# EAGLE design REV14 (EAGLE 7.4.0)
RFM95W
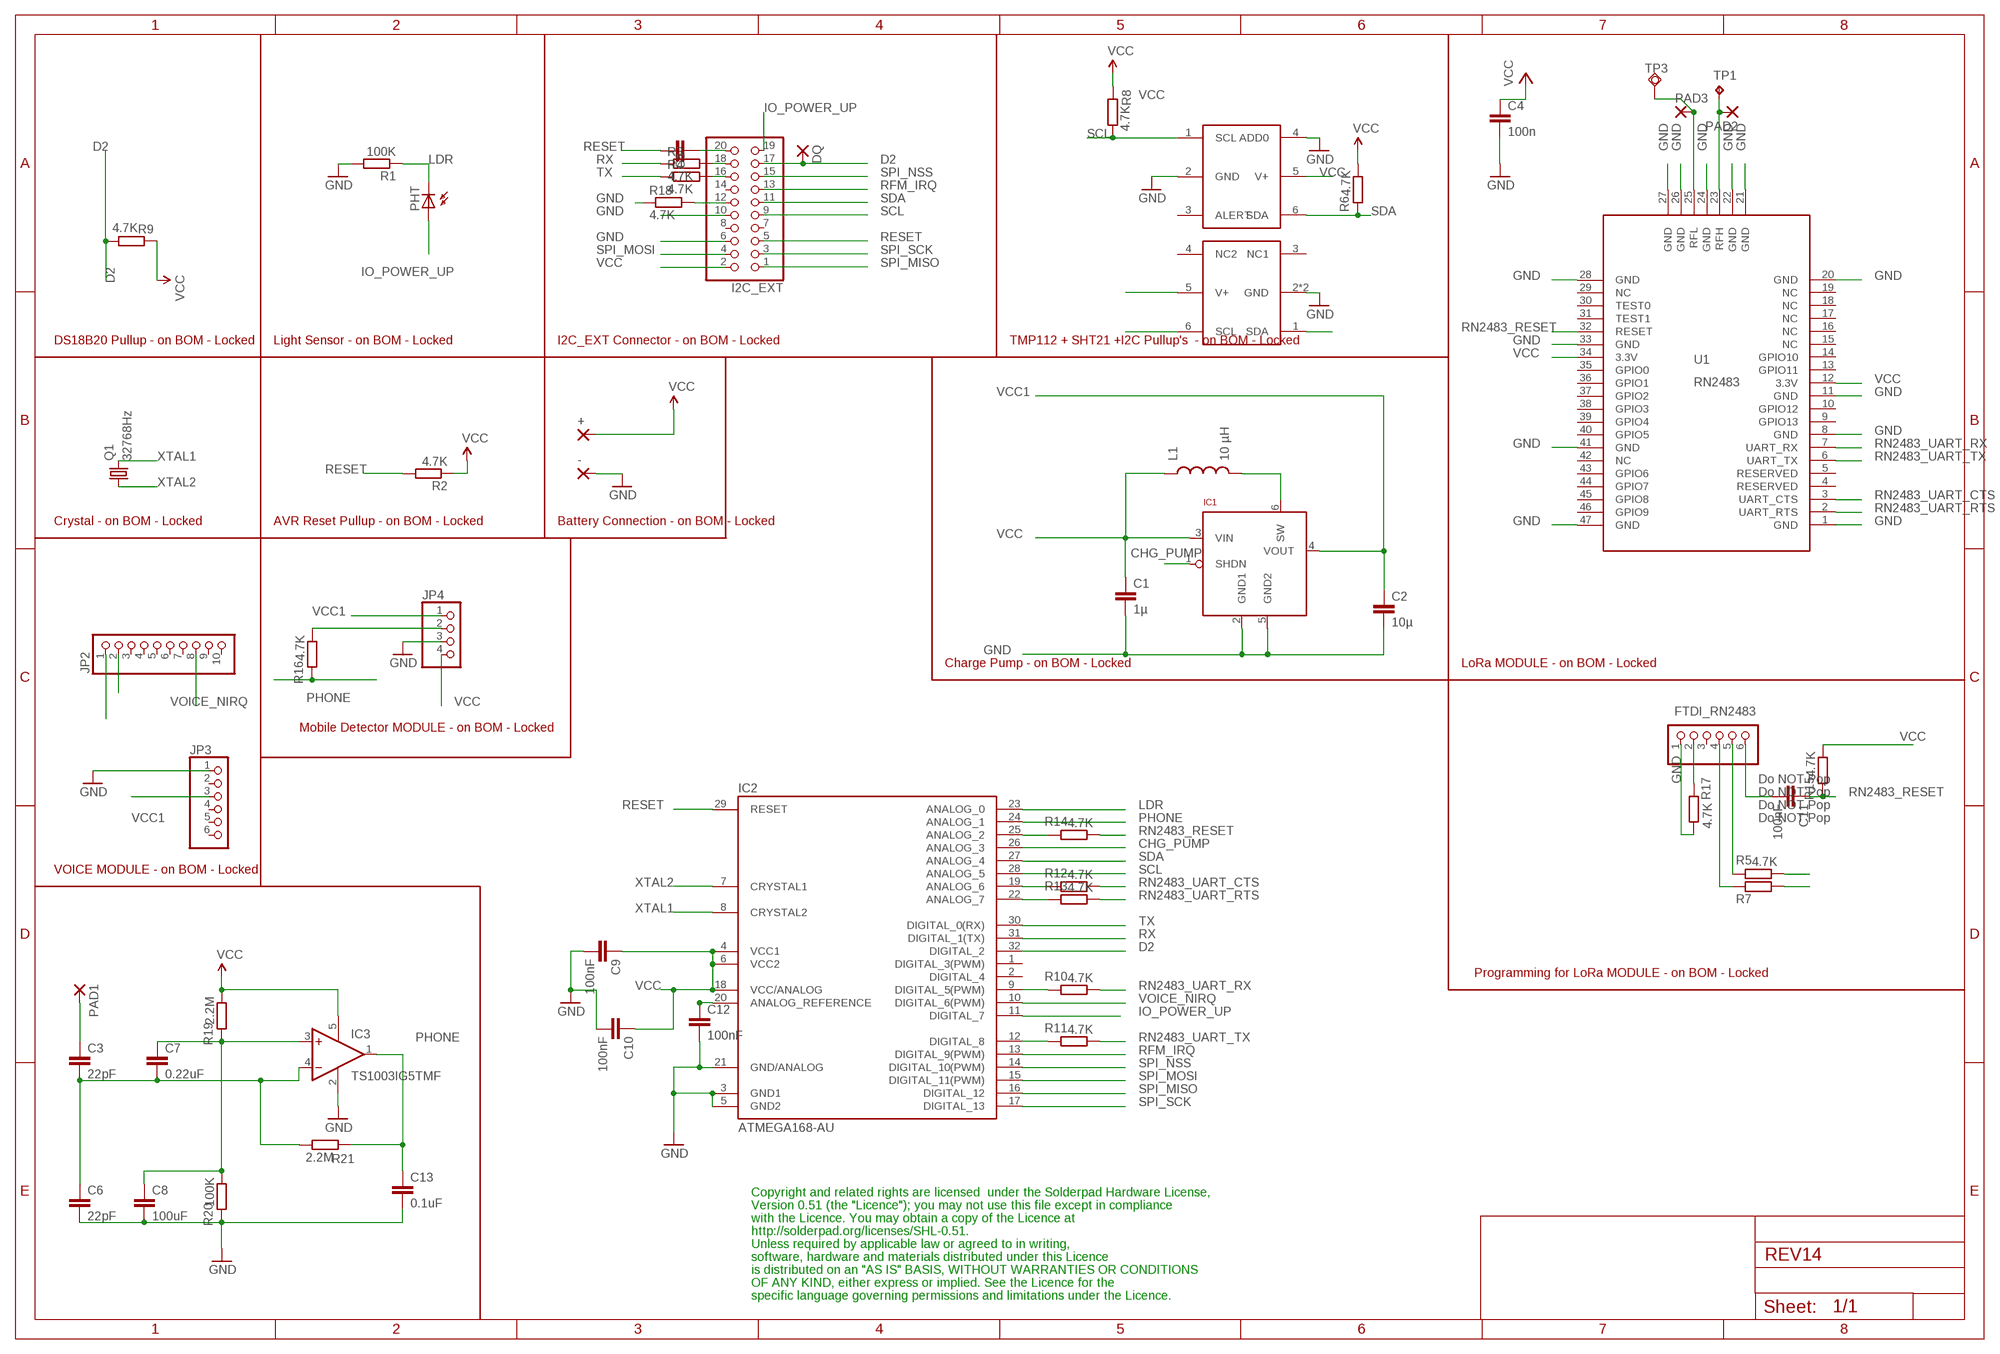
[diagram p0: schematic, sheet 1]

## Parts
+  2,15/1,0  [2,15/1,0]
-  2,15/1,0  [2,15/1,0]
C1  1µ  CAP0603-CAP  [0603-CAP]
C2  10µ  C-EUC0603  [C0603]
C3  22pF  C-EUC0603  [C0603]
C4  100n  C-EUC0603  [C0603]
C5  100nF  C-EUC0603  [C0603]
C6  22pF  C-EUC0603  [C0603]
C7  0.22uF  C-EU050H075X075  [C050H075X075]
C8  100uF  C-EUC1206  [C1206]
C9  100nF  C-EUC0603  [C0603]
C10  100nF  C-EUC0603  [C0603]
C11  100nF  C-EUC0603  [C0603]
C12  100nF  C-EUC0603  [C0603]
C13  0.1uF  C-EUC0603  [C0603]
DQ  2,15/1,0  [2,15/1,0]
FTDI_RN2483  PINHD-1X6  [1X06]
I2C_EXT  PINHD-2X10  [2X10]
IC1  LTC3525  [SC70]
IC2  ATMEGA168-AU  [TQFP32-08]
IC3  TS1003IG5TMF  [TS1003IG5T]
JP2  PINHD-1X10  [1X10]
JP3  PINHD-1X6  [1X06]
JP4  PINHD-1X4  [1X04]
L1  10 µH  INDUCTOR1210  [1210]
PAD1  2,15/1,0  [2,15/1,0]
PAD2  2,15/1,0  [2,15/1,0]
PAD3  2,15/1,0  [2,15/1,0]
PHT  BPX65  [BPX65]
Q1  32768Hz  MC-306  [MC-306]
R1  100K  R-EU_R0603  [R0603]
R2  4.7K  R-EU_R0603  [R0603]
R3  4.7K  R-EU_R0603  [R0603]
R4  4.7K  R-EU_R0603  [R0603]
R5  4.7K  R-EU_R0603  [R0603]
R6  4.7K  R-EU_R0603  [R0603]
R7  4.7K  R-EU_R0603  [R0603]
R8  4.7K  R-EU_R0603  [R0603]
R9  4.7K  R-EU_R0603  [R0603]
R10  4.7K  R-EU_R0603  [R0603]
R11  4.7K  R-EU_R0603  [R0603]
R12  4.7K  R-EU_R0603  [R0603]
R13  4.7K  R-EU_R0603  [R0603]
R14  4.7K  R-EU_R0603  [R0603]
R15  4.7K  R-EU_R0603  [R0603]
R16  4.7K  R-EU_R0603  [R0603]
R17  4.7K  R-EU_R0603  [R0603]
R18  4.7K  R-EU_R0603  [R0603]
R19  2.2M  R-EU_R0603  [R0603]
R20  100K  R-EU_R0603  [R0603]
R21  2.2M  R-EU_R0603  [R0603]
TP1  TPB1,27  [B1,27]
TP3  TPSQTP07R  [TP07R]
U1  RN2483  [RN2483]
U2  TMP112  [TMP112]
U$4  SHT21  [SHT21]

## Nets
CHG_PUMP [supply]: IC1.1(SHDN) IC2.26(ANALOG_3)
D2: DQ.1(P) I2C_EXT.17 IC2.32(DIGITAL_2) R9.1
GND [supply]: -.1(P) C1.2 C2.2 C4.2 C6.2 C8.2 C9.2 C10.2 C12.2 C13.2 FTDI_RN2483.1 I2C_EXT.6 I2C_EXT.10 IC1.2(GND1) IC1.5(GND2) IC2.3(GND1) IC2.5(GND2) IC2.21(GND/ANALOG) IC3.2(V-) JP3.1 JP4.3 R1.2 R17.2 R18.1 R20.2 U1.1(GND) U1.8(GND) U1.11(GND) U1.20(GND) U1.21(GND) U1.22(GND) U1.24(GND) U1.26(GND) U1.27(GND) U1.28(GND) U1.33(GND) U1.41(GND) U1.47(GND) U2.2(GND) U2.4(ADD0) U$4.2(GND) U$4.P$1(GND)
IO_POWER_UP [supply]: I2C_EXT.19 IC2.11(DIGITAL_7) PHT.A
LDR: IC2.23(ANALOG_0) PHT.K(C) R1.1
N$1: I2C_EXT.18 R3.2
N$2: C11.2 FTDI_RN2483.6
N$3: I2C_EXT.16 R4.2
N$4: C5.2 I2C_EXT.20
N$5: FTDI_RN2483.4 R7.2
N$6 [supply]: C12.1 IC2.20(ANALOG_REFERENCE)
N$7: FTDI_RN2483.5 R5.2
N$8: IC2.9(DIGITAL_5(PWM)) R10.2
N$9: IC2.12(DIGITAL_8) R11.2
N$10 [supply]: IC1.6(SW) L1.2
N$11: IC2.19(ANALOG_6) R12.2
N$12: IC2.22(ANALOG_7) R13.2
N$13: IC2.25(ANALOG_2) R14.2
N$14: FTDI_RN2483.2 R17.1
N$16: JP4.2 R16.1
N$17 [supply]: I2C_EXT.12 R18.2
N$18: C3.1 PAD1.1(P)
N$19: C3.2 C6.1 C7.2 IC3.4(-IN) R21.1
N$21: C7.1 C8.1 IC3.3(+IN) R19.2 R20.1
N$22 [ant]: PAD2.1(P) TP1.TP U1.23(RFH)
N$33 [ant]: PAD3.1(P) TP3.TP U1.25(RFL)
PHONE: C13.1 IC2.24(ANALOG_1) IC3.1(OUT) R16.2 R21.2
RESET: C5.1 I2C_EXT.5 IC2.29(RESET) R2.2
RFM_IRQ: I2C_EXT.13 IC2.13(DIGITAL_9(PWM))
RN2483_RESET: C11.1 R14.1 R15.2 U1.32(RESET)
RN2483_UART_CTS: R12.1 U1.3(UART_CTS)
RN2483_UART_RTS: R13.1 U1.2(UART_RTS)
RN2483_UART_RX: R7.1 R10.1 U1.7(UART_RX)
RN2483_UART_TX: R5.1 R11.1 U1.6(UART_TX)
RX: IC2.31(DIGITAL_1(TX)) R3.1
SCL: I2C_EXT.9 IC2.28(ANALOG_5) JP2.1 R8.1 U2.1(SCL) U$4.6(SCL)
SDA: I2C_EXT.11 IC2.27(ANALOG_4) JP2.2 R6.2 U2.6(SDA) U$4.1(SDA)
SPI_MISO: I2C_EXT.1 IC2.16(DIGITAL_12)
SPI_MOSI: I2C_EXT.4 IC2.15(DIGITAL_11(PWM))
SPI_NSS: I2C_EXT.15 IC2.14(DIGITAL_10(PWM))
SPI_SCK: I2C_EXT.3 IC2.17(DIGITAL_13)
TX: IC2.30(DIGITAL_0(RX)) R4.1
VCC [supply]: +.1(P) C1.1 C4.1 C9.1 C10.1 I2C_EXT.2 IC1.3(VIN) IC2.4(VCC1) IC2.6(VCC2) IC2.18(VCC/ANALOG) IC3.5(V+) JP4.4 L1.1 R2.1 R6.1 R8.2 R9.2 R15.1 R19.1 U1.12(3.3V) U1.34(3.3V) U2.5(V+) U$4.5(V+)
VCC1 [supply]: C2.1 IC1.4(VOUT) JP3.3 JP4.1
VOICE_NIRQ: IC2.10(DIGITAL_6(PWM)) JP2.8
XTAL1: IC2.8(CRYSTAL2) Q1.4
XTAL2: IC2.7(CRYSTAL1) Q1.1
Unconnected: FTDI_RN2483.3 I2C_EXT.7 I2C_EXT.8 I2C_EXT.14 IC2.1(DIGITAL_3(PWM)) IC2.2(DIGITAL_4) JP2.3 JP2.4 JP2.5 JP2.6 JP2.7 JP2.9 JP2.10 JP3.2 JP3.4 JP3.5 JP3.6 U1.4(RESERVED) U1.5(RESERVED) U1.9(GPIO13) U1.10(GPIO12) U1.13(GPIO11) U1.14(GPIO10) U1.15(NC) U1.16(NC) U1.17(NC) U1.18(NC) U1.19(NC) U1.29(NC) U1.30(TEST0) U1.31(TEST1) U1.35(GPIO0) U1.36(GPIO1) U1.37(GPIO2) U1.38(GPIO3) U1.39(GPIO4) U1.40(GPIO5) U1.42(NC) U1.43(GPIO6) U1.44(GPIO7) U1.45(GPIO8) U1.46(GPIO9) U2.3(ALERT) U$4.3(NC1) U$4.4(NC2)

## Notes on the sheet
- DS18B20 Pullup - on BOM - Locked | Light Sensor - on BOM - Locked | I2C_EXT Connector - on BOM - Locked | TMP112 + SHT21 +I2C Pullup's  - on BOM - Locked
- Crystal - on BOM - Locked | AVR Reset Pullup - on BOM - Locked | Battery Connection - on BOM - Locked
- Charge Pump - on BOM - Locked | LoRa MODULE - on BOM - Locked
- Mobile Detector MODULE - on BOM - Locked
- Do NOT Pop
- Do NOT Pop
- Do NOT Pop
- Do NOT Pop
- VOICE MODULE - on BOM - Locked
- Programming for LoRa MODULE - on BOM - Locked
- Copyright and related rights are licensed  under the Solderpad Hardware License,
- Version 0.51 (the "Licence"); you may not use this file except in compliance
- with the Licence. You may obtain a copy of the Licence at
- http://solderpad.org/licenses/SHL-0.51.
- Unless required by applicable law or agreed to in writing,
- software, hardware and materials distributed under this Licence
- is distributed on an "AS IS" BASIS, WITHOUT WARRANTIES OR CONDITIONS
- OF ANY KIND, either express or implied. See the Licence for the
- specific language governing permissions and limitations under the Licence.

## Library data of the parts
+ - DQ PAD1-PAD3 = wirepad:2,15/1,0: THROUGH-HOLE PAD
C1 = SparkFun:CAP: Capacitor Standard 0603 ceramic capacitor, and 0.1" leaded capacitor.
C2 C4 C7 C8 = rcl:C-EU: CAPACITOR, European symbol
C3 C5 C6 C9-C13 = resistor:C-EU: CAPACITOR, European symbol
FTDI_RN2483 JP3 = pinhead:PINHD-1X6: PIN HEADER
I2C_EXT = pinhead:PINHD-2X10: PIN HEADER
IC1 = JeeLabs:LTC3525
IC2 = Arduino-AVR:ATMEGA168
IC3 = TS1003IG5T:TS1003IG5T: Low Power Single Op Amp Source: http://cache.national.com/ds/LM/LM321.pdf
JP2 = pinhead:PINHD-1X10: PIN HEADER
JP4 = pinhead:PINHD-1X4: PIN HEADER
L1 = SparkFun:INDUCTOR: Inductors Basic Inductor/Choke - 0603 and 1206. Footprints are not proven and vary greatly between part numbers.
PHT = opto-trans-siemens:BPX65: PHOTO DIODE; MPN: BPX65.; OC_FARNELL: 327451; OC_NEWARK: 06WX2764
Q1 = crystal:MC-306: kHz RANGE CRYSTAL UNIT SMD Source: MC-306_405_406_E07X.PDF Homepage <http://www.epsontoyocom.co.jp>; MPN: MC-306 60.0KHZ 100PPM ,12.5PF; OC_FARNELL: 1278040; OC_NEWARK: 31M5576
R1-R21 = resistor:R-EU_: RESISTOR, European symbol
TP1 = testpad:TP: Test pad
TP3 = testpad:TPSQ: Test pad
U1 = RFM95W-RN2483:RN2483
U2 = TMP112_2:TMP112
U$4 = SHT21:SHT21: Tempsensor RS No: 709-8868 MRF No: TMP112AIDRLT

## Net classes
0 default: width 0.203 mm, drill 0.5 mm
1 supply: width 0.4 mm, drill 0.5 mm, clearance 0.203 mm
2 ant: width 2.184 mm, drill 0.5 mm

## Board
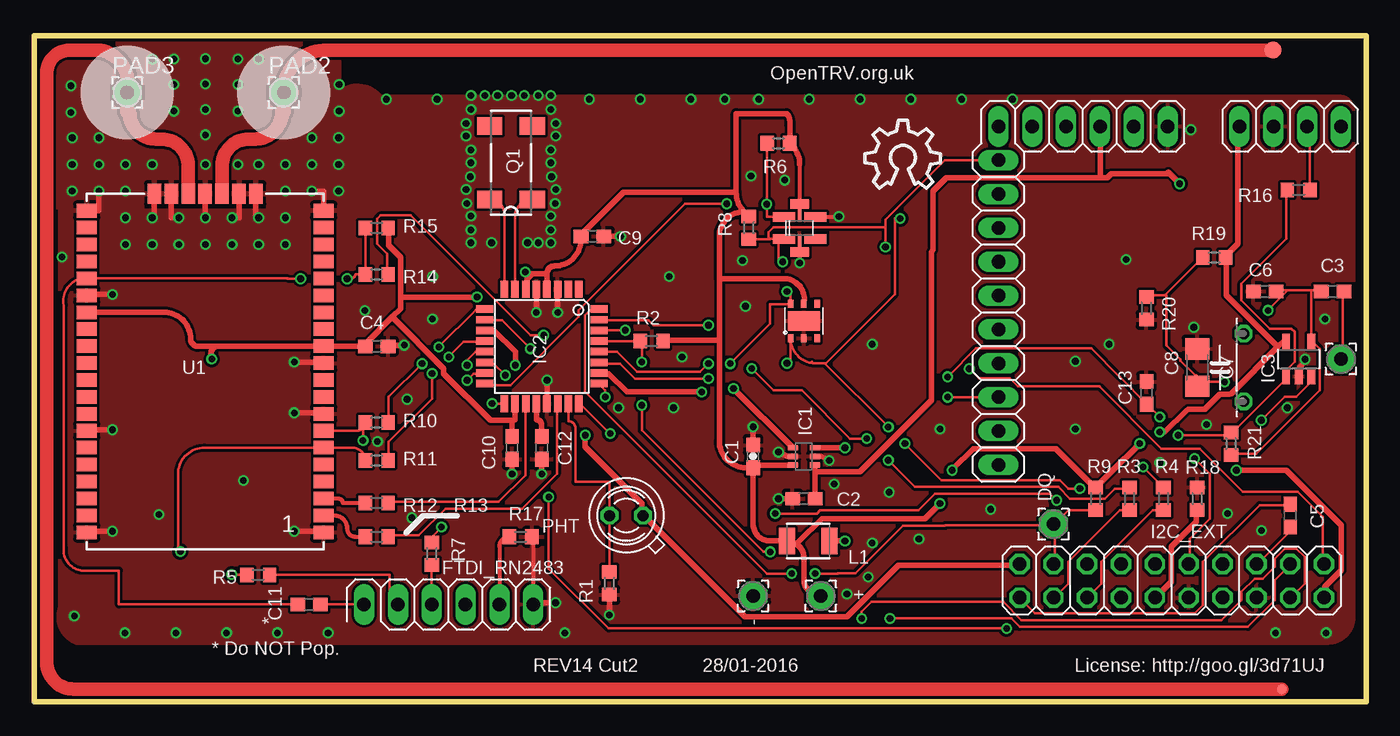
[diagram p1: board, top side]
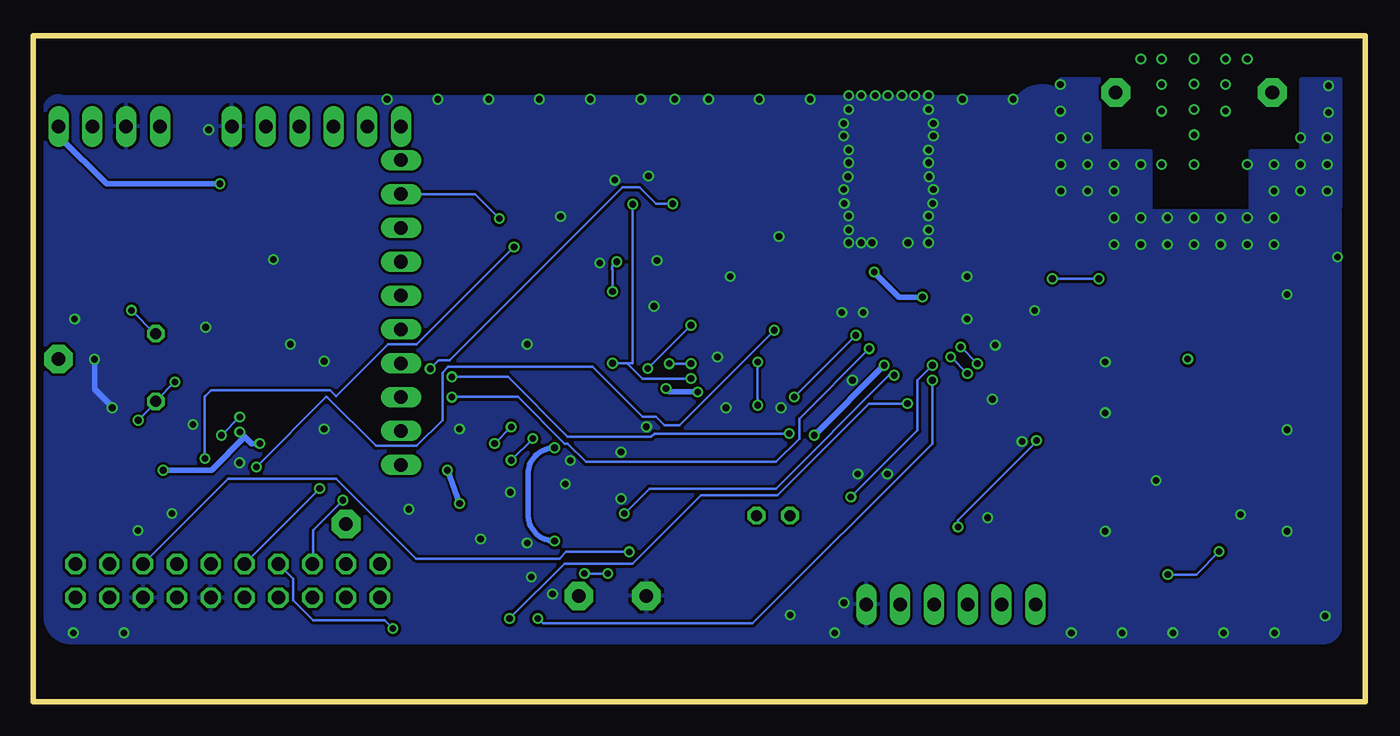
[diagram p2: board, bottom side, seen from below]

Size 100 x 50 mm. Coordinates in mm from the lower left corner, seen from the top.
Outline: 0,50 0,0 100,0 100,50 0,50
Copper layers (1*16): Top 0.035mm / dielectric 1.5mm / Bottom 0.035mm
Design rules "PMServicesStd *": minimum track width 8mil, minimum drill 0.5mm, track to track 8mil, track to pad 8mil, pad to pad 8mil, via to via 8mil, smd to smd 0mil, copper to edge 10mil, drill to drill 10mil, minimum pad ring 10mil, minimum via ring 6mil, stop-mask expansion 2mil, vias tented up to drill 100mil, thermal gap 10mil

### Footprints (pad centres in the part's own frame; a part is rotated, then mirrored left to right if it is on the bottom)
2,15/1,0 = drill 1.016 pad 2.159 octagon: 1 0,0
0603-CAP = smd 1.1 x 1: 1 -0.85,0; 2 0.85,0
C0603 = smd 1.1 x 1: 1 -0.85,0; 2 0.85,0
C050H075X075 = drill 0.813 octagon: 1 -2.54,0; 2 2.54,0
C1206 = smd 1.6 x 1.8: 1 -1.4,0; 2 1.4,0
1X06 = drill 1.016 long: 1 -6.35,0; 2 -3.81,0; 3 -1.27,0; 4 1.27,0; 5 3.81,0; 6 6.35,0
2X10 = drill 1.016 octagon: 1 -11.43,-1.27; 2 -11.43,1.27; 3 -8.89,-1.27; 4 -8.89,1.27; 5 -6.35,-1.27; 6 -6.35,1.27; 7 -3.81,-1.27; 8 -3.81,1.27; 9 -1.27,-1.27; 10 -1.27,1.27; 11 1.27,-1.27; 12 1.27,1.27; 13 3.81,-1.27; 14 3.81,1.27; 15 6.35,-1.27; 16 6.35,1.27; 17 8.89,-1.27; 18 8.89,1.27; 19 11.43,-1.27; 20 11.43,1.27
SC70 = smd 0.4 x 0.75: 1 -0.65,-0.825; 2 0,-0.825; 3 0.65,-0.825; 4 0.65,0.825; 5 0,0.825; 6 -0.65,0.825
TQFP32-08 = smd 1.27 x 0.559: 1 -4.293,2.8; 2 -4.293,2; 3 -4.293,1.2; 4 -4.293,0.4; 5 -4.293,-0.4; 6 -4.293,-1.2; 7 -4.293,-2; 8 -4.293,-2.8; 17 4.293,-2.8; 18 4.293,-2; 19 4.293,-1.2; 20 4.293,-0.4; 21 4.293,0.4; 22 4.293,1.2; 23 4.293,2; 24 4.293,2.8 | smd 0.559 x 1.27: 9 -2.8,-4.293; 10 -2,-4.293; 11 -1.2,-4.293; 12 -0.4,-4.293; 13 0.4,-4.293; 14 1.2,-4.293; 15 2,-4.293; 16 2.8,-4.293; 25 2.8,4.293; 26 2,4.293; 27 1.2,4.293; 28 0.4,4.293; 29 -0.4,4.293; 30 -1.2,4.293; 31 -2,4.293; 32 -2.8,4.293
TS1003IG5T = smd 0.6 x 1.2: 1 -0.95,-1.306; 2 0,-1.306; 3 0.95,-1.306; 4 0.95,1.306; 5 -0.95,1.306
1X10 = drill 1.016 long: 1 -11.43,0; 2 -8.89,0; 3 -6.35,0; 4 -3.81,0; 5 -1.27,0; 6 1.27,0; 7 3.81,0; 8 6.35,0; 9 8.89,0; 10 11.43,0
1X04 = drill 1.016 long: 1 -3.81,0; 2 -1.27,0; 3 1.27,0; 4 3.81,0
1210 = smd 1.2 x 2: 1 -1.6,0; 2 1.6,0
BPX65 = drill 0.813 octagon: A -0.889,-0.889; K 0.889,0.889
MC-306 = smd 1.3 x 1.9: 1 -2.75,-1.6; 2 2.75,-1.6; 3 2.75,1.6; 4 -2.75,1.6
R0603 = smd 1 x 1.1: 1 -0.85,0; 2 0.85,0
B1,27 = smd 1.27 x 1.27: TP 0,0
TP07R = smd 0.7 x 0.7: TP 0,0
RN2483 = smd 1.524 x 1.016: 1 17.78,1.27; 2 17.78,2.54; 3 17.78,3.81; 4 17.78,5.08; 5 17.78,6.35; 6 17.78,7.62; 7 17.78,8.89; 8 17.78,10.16; 9 17.78,11.43; 10 17.78,12.7; 11 17.78,13.97; 12 17.78,15.24; 13 17.78,16.51; 14 17.78,17.78; 15 17.78,19.05; 16 17.78,20.32; 17 17.78,21.59; 18 17.78,22.86; 19 17.78,24.13; 20 17.78,25.4; 28 0,25.4; 29 0,24.13; 30 0,22.86; 31 0,21.59; 32 0,20.32; 33 0,19.05; 34 0,17.78; 35 0,16.51; 36 0,15.24; 37 0,13.97; 38 0,12.7; 39 0,11.43; 40 0,10.16; 41 0,8.89; 42 0,7.62; 43 0,6.35; 44 0,5.08; 45 0,3.81; 46 0,2.54; 47 0,1.27 | smd 1.016 x 1.524: 21 12.7,26.67; 22 11.43,26.67; 23 10.16,26.67; 24 8.89,26.67; 25 7.62,26.67; 26 6.35,26.67; 27 5.08,26.67
TMP112 = smd 0.285 x 0.7: 1 -0.5,-0.825; 2 0,-0.825; 3 0.5,-0.825; 4 0.5,0.825; 5 0,0.825; 6 -0.5,0.825; 7 0.777,-0.825; 8 1.325,-0.825; 9 1.05,-0.825; 10 1.868,-0.826; 11 1.595,-0.826; 12 -1.863,-0.825; 13 -1.314,-0.825; 14 -1.59,-0.825; 15 -0.772,-0.825; 16 -1.044,-0.825; 17 -1.86,0.822; 18 -1.312,0.822; 19 -1.587,0.822; 20 -0.769,0.821; 21 -1.041,0.821; 22 0.766,0.824; 23 1.315,0.824; 24 1.039,0.824; 25 1.857,0.823; 26 1.585,0.823; 27 -0.548,1.797; 28 0,1.797; 29 -0.275,1.797; 30 0.543,1.797; 31 0.271,1.797; 32 0.001,1.383; 33 -0.548,-1.798; 34 0,-1.798; 35 -0.275,-1.798; 36 0.543,-1.799; 37 0.271,-1.799; 38 0,-1.322
SHT21 = smd 0.4 x 0.6: 1 -1,-1.3; 2 0,-1.3; 3 1,-1.3; 4 1,1.3; 5 0,1.3; 6 -1,1.3 | smd 2.4 x 1.5: P$1 0,0

### Placement (x,y rotation side)
+  59.05,7.94 270 top
-  53.98,7.94 270 top
C1  53.98,18.41 90 top
C2  57.78,15.24 180 top
C3  97.47,30.8 180 top
C4  25.72,26.67 0 top
C5  94.3,13.97 90 top
C6  92.39,30.8 180 top
C7  90.81,25.08 90 top
C8  87.31,25.08 90 top
C9  41.91,34.92 0 top
C10  35.88,19.05 270 top
C11  20.64,7.3 0 top
C12  38.1,19.05 270 top
C13  83.5,23.18 90 top
DQ  76.52,13.34 90 top
FTDI_RN2483  31.11,7.3 180 top
I2C_EXT  85.41,9.08 180 top
IC1  57.78,18.41 270 top
IC2  38.1,26.67 270 top
IC3  94.93,25.72 0 top
JP2  72.39,29.21 270 top
JP3  78.74,43.18 180 top
JP4  94.3,43.18 180 top
L1  58.1,12.06 0 top
PAD1  98.11,25.72 0 top
PAD2  18.73,45.72 0 top
PAD3  6.99,45.72 0 top
PHT  44.45,13.97 135 top
Q1  35.8,40.45 90 top
R1  43.18,8.89 270 top
R2  46.35,27.07 180 top
R3  82.23,15.24 270 top
R4  84.77,15.24 270 top
R5  16.83,9.53 0 top
R6  55.88,41.91 180 top
R7  29.84,11.11 270 top
R8  53.66,35.56 90 top
R9  79.69,15.24 90 top
R10  25.72,20.95 0 top
R11  25.72,18.1 0 top
R12  25.72,14.92 0 top
R13  25.72,12.38 0 top
R14  25.72,32.07 0 top
R15  25.72,35.56 180 top
R16  94.93,38.42 180 top
R17  36.51,12.38 0 top
R18  87.31,15.24 270 top
R19  88.58,33.34 180 top
R20  83.5,29.53 270 top
R21  89.85,19.37 90 top
TP1  93,48.9 0 top
TP3  93.66,0.95 0 top
U1  3.95,11.45 0 top
U2  57.47,35.56 0 top
U$1  [OSHW_10X200_NOTEXT]  62.38,38.54 0 top
U$4  57.78,28.57 0 top

### Tracks (layer width: path | path; a pad name or v marks a point on that pad's centre or on a via)
CHG_PUMP  (via drill 0.5)
  Top 0.4: v52.5,23.5 56.88,19.12 IC1.1 | v50.12,23.25 44.5,23.25 43.12,24.62 42.5,24.62 IC2.26
  Bottom 0.4: v52.5,23.5 52.25,23.25 v50.12,23.25
D2  (via drill 0.5)
  Top 0.203: R9.1 79.62,14.38 77.62,14.38 76.62,13.38 DQ.1 | v56.88,9.62 55,9.62 41.38,23.25 41.38,29 41.75,29.38 42.38,29.38 IC2.32 | v58.62,9.62 60.33,9.62 60.35,9.65 61.67,9.65 65.23,13.21 68.38,13.21 68.39,13.25 76.5,13.25 DQ.1 | I2C_EXT.17 76.62,10.38 76.62,13.25 DQ.1
  Bottom 0.203: v58.62,9.62 v56.88,9.62
GND  (via drill 0.5)
  Top 0.305: U2.4 60.42,36.38 | U2.2 v57.47,32.93 | R17.2 arc-90 37.47,12.28 FTDI_RN2483.1
  Top 0.4: v95.4,25.7 95.4,25.5 95,25.09 95,24.49 IC3.2
  Top 0.406: 60.42,36.38 v60.42,36.42 | C4.2 26.57,26.76 v27.78,26.76 | U1.11 21.73,25.49 v19.52,25.49 | IC2.21 v38.5,24.13 | IC2.5 v37.7,29.21 | IC2.3 v39.3,29.21 | C10.2 v35.88,17.09 | R1.2 v43.18,6.51 | C9.2 v44.02,34.92 | U1.1 21.73,12.79 v19.52,12.79 | U1.8 21.73,21.68 v19.52,21.68 | U1.47 3.95,12.79 v5.87,12.79 | U1.41 3.95,20.41 v5.87,20.41 | U1.33 3.95,30.57 v5.87,30.57 | U1.20 21.73,38.32 v20.86,38.32 | v4.86,38.32 4.86,36.85 U1.28 | U1.21 16.65,36.32 v16.86,36.32 | U1.22 15.38,36.32 v14.86,36.32 | U1.24 12.84,36.32 v12.86,36.32 | U1.26 10.3,36.32 v10.86,36.32 | U1.27 9.03,36.32 v8.86,36.32 | FTDI_RN2483.1 37.47,7.43 v39.15,7.43 | C12.2 v38.1,17.09 | IC1.5 59.05,18.41 v59.69,18.1 | IC1.2 56.52,18.41 v55.88,18.73 | C1.2 v53.98,20.64 v53.97,20.64 | C2.2 v55.88,15.24
  Bottom 0.4: v95.4,25.7 95.4,23.47 94.08,22.15 v94.07,22.07
  other vias: 14.86,34.32 18.86,34.32 18.86,36.32 16.86,34.32 12.86,34.32 10.86,34.32 8.86,34.32 6.86,34.32 6.86,36.32 6.86,38.32 6.86,40.32 4.86,40.32 2.86,40.32 2.86,38.32 4.86,42.32 2.86,42.32 2.76,44.23 2.76,46.23 8.86,40.32 12.86,40.32 15.3,40.32 16.86,40.32 18.86,40.32 18.86,38.32 20.86,40.32 20.86,42.32 22.86,42.32 22.86,40.32 22.86,38.32 32.8,45.5 34.8,45.5 38.8,45.5 36.8,45.5 32.8,34.45 34.34,34.45 38.8,34.45 37.04,34.45 32.43,38.45 32.8,40.45 32.8,44.45 32.43,42.45 32.8,36.45 39.16,38.45 38.8,40.45 38.8,44.45 39.16,42.45 38.8,36.45 86.83,42.92 12.86,46.35 12.86,44.45 12.86,42.55 15.71,16.6 9.37,14.06 53.81,39.46 56.35,39.15 53.18,33.11 37.84,34.45 38.8,35.4 38.84,39.4 38.8,41.4 39.16,43.4 39.11,37.4 32.8,35.4 32.75,39.4 32.8,41.4 32.43,43.4 32.48,37.4 33.84,45.5 37.84,45.5 35.84,45.5 22.89,44.32 22.89,46.32 15.3,44.32 15.3,46.32 10.49,44.32 10.49,46.32 8.86,48.23 16.86,48.23 12.86,48.26 15.3,48.23 10.49,48.23 3.02,6.44 2.1,33.37 61.02,8.1 62.61,9.37 66.42,12.22 64.19,15.72 60.07,16.35 89.59,14.13 84.52,17.94 80.7,26.83 81.97,33.18 87.06,28.1 47.69,31.91 62.92,26.83 29.91,31.91 24.82,29.37 53.4,29.69 48,22.07 29.91,28.73 71.81,14.45 28.35,13.81 28,22.7 25.78,19.53 48.64,25.88 43.88,22.07 62.92,11.91 92.14,12.86 88.01,20.8 96.9,28.73 26.45,45.21 30.25,45.21 41.69,45.21 45.49,45.21 49.3,45.21 51.84,45.21 54.38,45.21 58.2,45.21 62.01,45.21 65.81,45.21 69.62,45.21 73.44,45.21 6.83,5.17 10.63,5.17 14.45,5.17 18.25,5.17 22.07,5.17 39.84,5.17 97,5.17 93.19,5.17 68,20.48 78.17,20.48 78.17,25.56
  pour Top: 22.86,50 22.86,37.15 0,37.15 0,50
  pour Top: 4.76,49.85 4.76,37.15 1.91,37.15 1.91,49.85
  pour Bottom: 4.76,46.67 4.76,37.15 1.91,37.15 1.91,46.67
  pour Top: 20,37.47 20,41.27 16.19,41.27 16.19,37.47
  pour Bottom: 20,36.2 20,41.27 16.19,41.27 16.19,36.2
  pour Bottom: 8.57,36.2 8.57,41.27 4.76,41.27 4.76,36.2
  pour Top: 8.57,37.47 8.57,49.85 4.76,49.85 4.76,37.47
  pour Bottom: 22.86,46.67 22.86,37.15 20,37.15 20,46.67
  pour Top: 22.86,46.67 22.86,37.15 20,37.15 20,46.67
  pour Top: 22.86,24.13 22.86,5.08 arc90 19.68,4.45 97.16,4.45 arc90 99.06,6.35 99.06,44.45 arc90 97.79,45.4 26.04,45.4 arc90 22.86,45.72 22.86,28.26 arc90
  pour Bottom: 22.86,24.13 22.86,10.16 arc90 23.5,4.45 97.16,4.45 arc90 99.06,6.35 99.06,44.77 arc90 97.79,45.4 26.04,45.4 arc90 22.86,45.72 22.86,28.26 arc90
  pour Top: 24.13,36.83 1.91,36.83 1.91,6.99 arc90 3.17,4.45 26.04,4.45 26.04,34.92 arc90
  pour Bottom: 24.13,36.83 1.91,36.83 1.91,5.71 arc90 3.17,4.45 26.04,4.45 26.04,34.92 arc90
IO_POWER_UP  (via drill 0.5)
  Top 0.4: v36.12,25.25 36.12,26.25 34.5,27.88 33.88,27.88 IC2.11 | v41.38,20 41.38,19.12 45.62,14.88 45.62,14 PHT.A 45.88,13.88 53.38,6.38 61,6.38 64.88,10.25 73.88,10.25 I2C_EXT.19
  Bottom 0.4: v41.38,20 v36.12,25.25
LDR
  Top 0.203: R1.1 PHT.K 43.19,16.51 40.64,16.51 40.64,20.52 arc90 40.1,21.06 IC2.23
N$1
  Top 0.203: R3.2 82.12,14.38 81.5,14.38 77.62,10.5 77.62,8.88 76.62,7.88 I2C_EXT.18
N$2
  Top 0.203: C11.2 FTDI_RN2483.6
N$3
  Top 0.203: R4.2 84.75,14.38 84,14.38 80.12,10.5 80.12,8.88 79.12,7.88 I2C_EXT.16
N$4
  Top 0.203: C5.2 94.25,14.75 92,14.75 87.75,10.5 87.75,7.25 87.12,6.62 75.12,6.62 74,7.75 I2C_EXT.20
N$5
  Top 0.203: R7.2 FTDI_RN2483.4
N$6
  Top 0.406: IC2.20 37.7,21.17 arc-90 38.1,20.77 C12.1
N$7
  Top 0.203: R5.2 26.67,9.53 26.67,7.62 FTDI_RN2483.5
N$8  (via drill 0.5)
  Top 0.203: v29.12,25.38 26.62,22.88 26.62,21 R10.2 | v30.38,26.62 33.12,29.38 33.75,29.38 IC2.9
  Bottom 0.203: v30.38,26.62 v29.12,25.38
N$9  (via drill 0.5)
  Top 0.203: v29.88,24.62 29.88,22.75 26.62,19.5 26.62,18.12 R11.2 | v31.12,25.88 32.25,27 33.75,27 IC2.12
  Bottom 0.203: v31.12,25.88 v29.88,24.62
N$10  (via drill 0.5)
  Top 0.406: L1.2 v60.87,12.06 | v60.87,19.07 IC1.6
  Bottom 0.406: v60.87,12.06 arc90 62.87,14.06 62.87,17.07 arc90 v60.87,19.07
N$11
  Top 0.203: R12.2 26.62,15 34.88,15 36.88,17 36.88,22.38 IC2.19
N$12
  Top 0.203: R13.2 26.62,12.5 28.88,12.5 30.88,14.5 36.62,14.5 39.25,17.12 39.25,22.38 IC2.22
N$13  (via drill 0.5)
  Top 0.203: v38.25,27.5 37.25,27.5 28.25,36.5 26,36.5 25.75,36.25 25.75,34.38 26.5,33.62 26.5,32.12 R14.2 | v42.88,22.88 42.88,23.38 42.5,23.75 IC2.25
  Bottom 0.203: v42.88,22.88 v38.25,27.5
N$14
  Top 0.305: R17.1 arc90 34.92,11.64 FTDI_RN2483.2
N$16
  Top 0.203: R16.1 95.75,38.5 95.75,43 95.62,43.12 JP4.2
N$17
  Top 0.4: R18.2 87.25,14.38 87.25,13.5 85.38,11.62 85.38,9 84.25,7.88 I2C_EXT.12
N$18
  Top 0.203: C3.1 98.25,30.75 98.25,25.88 98.12,25.75 PAD1.1
N$19  (via drill 0.5)
  Top 0.203: 95.88,30.88 96.5,30.88 C3.2 | 95.88,30.88 94.12,30.88 | 94.12,30.88 93.25,30.88 C6.1 | R21.1 89.88,18.62 91.75,18.62 96.5,23.38 96.5,26.5 96,27 IC3.4 95.88,27.12 95.88,30.88 | 94.12,30.88 v92.62,29.38
  Bottom 0.203: v92.62,29.38 90.88,27.62 C7.2
N$21  (via drill 0.5)
  Top 0.203: v92.12,21.12 93.88,22.88 94.75,22.88 95.88,24 95.88,24.38 IC3.3 | 84.94,30.56 87.62,33.25 R19.2 | 84.94,30.56 84.88,30.5 83.62,30.5 R20.1 | 87.25,24.5 87.25,24.49 | 87.25,24.49 87.25,24.25 C8.1 87.38,24.12 87.5,24 v89.38,24 | 84.94,30.56 85,30.5 85,26.75 85.04,26.72 86.06,25.7 86.06,25.6 87.17,24.49 87.25,24.49
  Bottom 0.203: v92.12,21.12 90.75,22.5 C7.1 90.75,22.62 v89.38,24
N$22
  Top 0.406: 18.73,44.23 18.6,44.23
  Top 1.016: U1.23 14.11,40.23 arc-90 16.11,42.23 16.6,42.23 arc90 18.6,44.23 | 18.73,44.23 PAD2.1 18.73,45.94 arc-90 22,48.9 TP1.TP
  Top 2.184: 18.8,45.72 PAD2.1
N$33
  Top 0.406: 6.99,44.23 7.15,44.23
  Top 1.016: 7.15,44.23 arc90 9.15,42.23 9.57,42.23 arc-90 11.57,40.23 U1.25 | 6.99,44.23 PAD3.1 6.99,45.94 arc90 4.99,48.9 2.63,48.9 arc90 0.95,47.21 0.95,2.95 arc90 2.95,0.95 TP3.TP
  Top 2.184: 7.01,45.72 PAD3.1
PHONE  (via drill 0.5)
  Top 0.203: R16.2 94,38.38 94,34.75 90.62,31.38 90.62,30.12 92.75,28 94.38,28 94.62,27.75 94.62,25.5 94,24.88 94,24.5 IC3.1 93.88,24.38 93.88,24.12 89.88,20.12 R21.2 89.75,20.12 89.62,20 v85.88,20 | v84.5,21.38 83.62,22.25 C13.1 83.5,22.38 81.5,24.38 81.48,24.38 79.35,26.52 70.71,26.52 v68.58,24.38 | v43.25,20.12 41,22.38 IC2.24
  Bottom 0.203: v85.88,20 v84.5,21.38 | v43.25,20.12 53.38,20.12 53.62,19.88 59.88,19.88 64.38,24.38 68.25,24.38 68.28,24.38 v68.58,24.38
RESET  (via drill 0.5)
  Top 0.203: IC2.29 R2.2 45.62,27 v45.62,25.5 | C5.1 94.25,13 94.25,12.75 91.88,10.38 I2C_EXT.5 | v45.62,22.25 45.62,20.38 54.75,11.25 v55.25,11.25
  Bottom 0.203: v45.62,22.25 v45.62,25.5 | v55.25,11.25 60,11.25 60.5,10.75 71.25,10.75 77.25,16.75 85.38,16.75 91.75,10.38 I2C_EXT.5
RFM_IRQ  (via drill 0.5)
  Top 0.203: v32.5,25.25 32.5,25.62 33.12,26.25 33.75,26.25 IC2.13 | v38.62,15.38 38.62,10 43.12,5.5 v73,5.5
  Bottom 0.203: v32.5,25.25 33.62,24.12 33.62,20.38 v38.62,15.38 | v73,5.5 73.62,6.12 79,6.12 80.5,7.62 80.5,9.25 81.5,10.25 I2C_EXT.13
RN2483_RESET  (via drill 0.5)
  Top 0.203: v23.5,31.75 arc90 24.13,32.07 R14.1 R15.2 | v20,31.75 19.05,31.75 arc-90 19.03,31.77 U1.32 3.59,31.77 arc90 2.22,29.77 2.22,11.53 arc90 3.59,9.84 6.35,9.84 6.35,7.3 C11.1
  Bottom 0.203: v23.5,31.75 v20,31.75
RN2483_UART_CTS
  Top 0.305: U1.3 22.84,15.26 arc-90 22.86,15.24 arc-90 23.18,14.92 R12.1
RN2483_UART_RTS
  Top 0.305: U1.2 22.52,13.99 arc-90 23.5,13.02 arc90 24.13,12.38 R13.1
RN2483_UART_RX  (via drill 0.5)
  Top 0.203: U1.7 24.25,20.34 arc90 R10.1 24.69,20.42 v24.69,19.61 | v30.58,13.11 29.87,12.39 29.87,11.99 R7.1
  Bottom 0.203: v30.58,13.11 30.58,13.61 24.69,19.51 v24.69,19.61
RN2483_UART_TX  (via drill 0.5)
  Top 0.203: R11.1 arc90 23.9,19.07 U1.6 12.79,19.07 arc90 10.79,17.07 10.79,11.43 10.87,11.38 v10.97,11.28 | v14.83,9.55 15.95,9.55 R5.1
  Bottom 0.203: v14.83,9.55 12.7,9.55 v10.97,11.28
RX  (via drill 0.5)
  Top 0.203: v64.12,18.12 66.12,16.12 76.88,16.12 77.75,15.25 80.38,15.25 81.12,16 82.12,16 R3.1 | v62.5,19.75 61.25,19.75 57.62,23.38 55.5,23.38 v53.88,25 | v50.62,28.25 46.5,28.25 46.12,28.62 42.5,28.62 IC2.31
  Bottom 0.203: v62.5,19.75 v64.12,18.12 | v50.62,28.25 v53.88,25
SCL  (via drill 0.5)
  Top 0.203: 55.12,34.71 55.22,34.71 arc90 55.24,34.73 55.88,34.73 55.88,33.02 v56.2,33.02 | 55.12,34.71 R8.1 | 56.76,29.84 55.24,29.84 55.24,28.38 55.25,28.38 v52.25,25.38 | U$4.6 56.78,30.53 arc90 v56.52,30.8 | v50.62,25.38 50,24.75 45.25,24.75 43.75,26.25 42.5,26.25 IC2.28 | v87.12,18.25 88.25,17.12 88.25,13.75 86.75,12.25 86.75,10.38 I2C_EXT.9 | 55.12,34.71 55.12,35.25 55.5,35.62 63.88,35.62 | v63.91,34.14 63.91,35.56 63.88,35.62 | JP2.1 68.38,40.64 63.91,36.17 63.91,35.66 63.88,35.62
  Top 0.305: U2.1 55.88,34.73
  Top 0.406: U$4.6 arc-90 56.76,29.84
  Bottom 0.203: v56.52,30.8 56.52,32.38 arc90 v56.2,33.02 | v52.25,25.38 v50.62,25.38 | v87.12,18.25 87.12,22.88 87.07,22.96 86.67,23.37 77.72,23.37 77.27,22.91 73.36,26.82 71.22,26.82 v63.91,34.14
SDA  (via drill 0.5)
  Top 0.203: U2.6 55,36.38 v55,37.34 55,41.7 | 58.36,25.42 arc-81 U$4.1 56.78,25.67 arc-90 v56.52,25.4 | 58.36,25.42 arc9 58.66,25.4 59.37,25.4 | v50.62,24.25 45.12,24.25 44,25.38 42.5,25.38 IC2.27 | v78.5,16 77.62,16 77,16.62 68.12,16.62 v65.38,19.38 | v64.12,20.62 59.38,25.38 59.37,25.4 | 58.38,25.5 58.36,25.42 | 59.37,25.4 59.44,25.4 64.62,30.58 64.62,36.27 v65.02,36.27
  Top 0.406: 55,41.7 arc90 R6.2
  Bottom 0.203: v56.52,25.4 55.38,25.4 | 55.38,25.4 55,25.4 v55,37.34 | v50.62,24.25 54.25,24.25 55.38,25.38 55.38,25.4 | v78.5,16 84.12,10.38 I2C_EXT.11 | v64.12,20.62 v65.38,19.38 | JP2.2 66.85,38.1 v65.02,36.27
SPI_MISO  (via drill 0.5)
  Top 0.203: v52,37.38 48.88,37.38 40.88,29.38 40.88,28.88 35.75,23.75 33.88,23.75 IC2.16 | I2C_EXT.1 96.75,10.38 96.75,13.88 94.88,15.75 90.75,15.75 87.5,19 84.62,19 80,23.62 79.96,23.67 73.86,23.67 73.25,24.28 70.92,24.28 v70.21,24.99
  Bottom 0.203: v52,37.38 53.25,37.38 54.5,38.62 55.75,38.62 68.75,25.62 69.5,25.62 69.6,25.6 v70.21,24.99
SPI_MOSI  (via drill 0.5)
  Top 0.203: v32.5,24.12 33,24.62 33.75,24.62 IC2.15 | v62.12,6.25 62.12,6.75 62.88,7.5 72.75,7.5 74.12,6.12 89.12,6.12 90.62,7.62 90.62,8.25 91.62,9.25 92.25,9.25 93.12,10.12 93.12,10.75 93.88,11.5 94.75,11.5 95.38,10.88 95.38,8.88 94.38,7.88 I2C_EXT.4
  Bottom 0.203: v32.5,24.12 32.5,19.38 46,5.88 61.75,5.88 v62.12,6.25
SPI_NSS  (via drill 0.5)
  Top 0.203: v35.38,24.5 34.5,25.38 33.88,25.38 IC2.14 | v55.62,14.12 58.75,14.12 59,14.38 66.38,14.38 67.62,15.62 76.25,15.62 v76.75,15.12
  Bottom 0.203: v35.38,24.5 35.75,24.5 44.25,16 53.75,16 v55.62,14.12 | v76.75,15.12 79,12.88 79,10.38 I2C_EXT.15
SPI_SCK  (via drill 0.5)
  Top 0.203: v34.38,22.38 35.25,22.38 IC2.17 | v64.25,6.25 73.38,6.25 74,5.62 91.12,5.62 93.12,7.62 93.12,9.12 94.25,10.25 I2C_EXT.3
  Bottom 0.203: v34.38,22.38 37.25,22.38 44.12,15.5 49.88,15.5 55,10.38 60.12,10.38 v64.25,6.25
TX  (via drill 0.5)
  Top 0.203: v83.25,17.62 84.75,16.12 R4.1 | v44.38,27.88 42.5,27.88 IC2.30
  Bottom 0.203: v83.25,17.62 78,22.88 77.93,22.86 74.27,19.2 71.22,19.2 69.29,21.13 69.29,24.69 68.89,25.09 68.88,25.12 58,25.12 54.25,21.38 53.25,21.38 52.62,20.75 51.5,20.75 v44.38,27.88
VCC  (via drill 0.5)
  Top 0.305: 57.47,40.34 U2.5
  Top 0.4: 27.5,30.38 27.5,29.5 26.88,28.88 | 27.5,30.38 27.5,33.38 26.62,34.25 26.62,35.5 R15.1 | 26.88,28.88 24.88,26.88 C4.1 | 26.88,28.88 30.75,25 30.75,24.62 34.25,21.12 35.75,21.12 35.9,21.05 | 37.19,31.94 37.38,32.12 38.51,32.12 | 37.19,31.94 37,31.75 37,31 IC2.6 | 51.44,27.12 47.25,27.12 R2.1 | 52.7,38.25 44.25,38.25 41.12,35.12 C9.1 | v33.25,30.38 27.5,30.38 | 37.19,31.94 v36.88,32.25 | v83,19.38 80.88,17.25 | 80.88,17.25 79.75,16.12 R9.2 79.55,16.15 76.71,19 70.51,19 68.99,17.48 v68.91,17.38 | v84.5,20.25 84.88,20.25 86.48,21.86 86.67,21.95 87.88,21.95 89,23.06 89.71,23.06 89.88,23.12 93.38,26.62 | 93.38,26.62 93.88,27.12 IC3.5 | 93.38,26.62 89.5,30.5 89.5,33.25 R19.1 89.5,33.5 90.38,34.38 90.38,43.12 JP4.4 | v90.25,17.38 94,17.38 98.12,13.25 98.12,9.88 96.88,8.62 96.88,7.88 I2C_EXT.2 | v68,14.88 66.88,13.75 59.12,13.75 57.38,12 57.25,11.82 | 80.75,17.38 80.88,17.25
  Top 0.406: IC2.18 36.1,21.17 arc63 35.9,21.05 arc27 35.88,20.95 C10.1 | C9.1 41.06,34.7 arc-90 39.06,32.7 39.05,32.7 arc90 38.51,32.16 38.51,32.12 IC2.4 | C4.1 arc90 24.85,26.69 U1.12 arc-90 21.71,26.67 13.65,26.67 | 13.65,26.67 12.3,26.67 arc-90 11.75,27.23 arc90 9.75,29.23 U1.34 | C1.1 arc-90 54.17,17.77 IC1.3 | C1.1 53.98,13.34 arc90 55.24,12.06 L1.1 arc-36 57.25,11.82 arc-54 57.78,10.78 57.78,9.21 arc90 +.1 | v13.34,25.72 arc-90 13.65,26.67 | 57.47,40.34 arc45 56.88,41.76 R6.1 56.73,43.3 arc45 56.52,44.13 52.7,44.13 52.7,38.25 52.7,38.19 arc45 53.29,36.78 | R8.2 53.29,36.78 | 56.55,31.75 arc-90 U$4.5 arc90 56.55,31.75 | 51.44,31.75 51.44,34.92 arc-90 53.29,36.78 | 56.55,31.75 51.44,31.75 | 51.44,31.75 51.44,27.12 51.44,19.57 arc90 53.44,17.57 C1.1
  Bottom 0.4: v33.25,30.38 35,30.38 v36.88,32.25 | v83,19.38 83.62,19.38 84.12,19.88 | v84.5,20.25 84.12,19.88 | v90.25,17.38 86.62,17.38 84.12,19.88 | v68.91,17.38 v68,14.88
VCC1  (via drill 0.5)
  Top 0.4: 58.61,17.25 62,17.25 67.38,22.62 67.38,33.75 67.46,33.93 67.46,38.3 68.48,39.32 80.06,39.32 | 85.95,38.91 v86,38.88 85.85,39.01 85.14,39.73 85.04,39.62 80.87,39.62 80.57,39.32 80.06,39.32 | 80.06,39.32 80.06,43.18 JP3.3
  Top 0.406: IC1.4 58.61,17.25 58.61,15.31 arc90 C2.1
  Bottom 0.4: v86,38.88 94.5,38.88 98,42.38 98,43.12 JP4.1
VOICE_NIRQ  (via drill 0.5)
  Top 0.203: v37.25,26.5 35.12,28.62 33.88,28.62 IC2.10 | v68.58,22.86 JP2.8
  Bottom 0.203: v37.25,26.5 42.5,21.25 42.5,19.75 44.25,18 58.5,18 59.88,19.38 60.12,19.38 63.62,22.88 68.58,22.88 | 68.88,22.88 68.58,22.88 | v68.58,22.86 68.58,22.88
XTAL1
  Top 0.203: IC2.8 35.3,36.59 arc90 Q1.4
XTAL2
  Top 0.203: IC2.7 36.1,36.41 arc-90 Q1.1

### Text on the board
tNames: OpenTRV.org.uk | * | * Do NOT Pop. | REV14 Cut2 | 28/01-2016 | License: http://goo.gl/3d71UJ